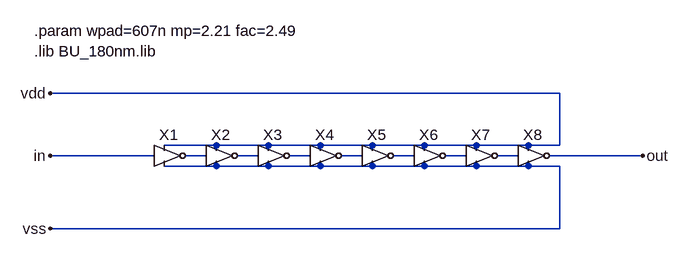
[diagram p0: schematic pad_buffer.asc]
pad_buffer.asc, the LTspice schematic file:
Version 4
SHEET 1 1168 680
WIRE 768 224 -16 224
WIRE 240 304 160 304
WIRE 320 304 240 304
WIRE 400 304 320 304
WIRE 480 304 400 304
WIRE 560 304 480 304
WIRE 640 304 560 304
WIRE 720 304 640 304
WIRE 768 304 768 224
WIRE 768 304 720 304
WIRE 144 320 -16 320
WIRE 224 320 192 320
WIRE 304 320 272 320
WIRE 384 320 352 320
WIRE 464 320 432 320
WIRE 544 320 512 320
WIRE 624 320 592 320
WIRE 704 320 672 320
WIRE 896 320 752 320
WIRE 240 336 160 336
WIRE 320 336 240 336
WIRE 400 336 320 336
WIRE 480 336 400 336
WIRE 560 336 480 336
WIRE 640 336 560 336
WIRE 720 336 640 336
WIRE 768 336 720 336
WIRE 768 432 768 336
WIRE 768 432 -16 432
FLAG -16 224 vdd
FLAG -16 320 in
FLAG 896 320 out
FLAG -16 432 vss
SYMBOL inv 160 320 R0
SYMATTR InstName X1
SYMATTR SpiceLine ll=180n wn={wpad} wp={wpad*mp}
SYMBOL inv 240 320 R0
SYMATTR InstName X2
SYMATTR SpiceLine ll=180n wn={wpad*fac} wp={wpad*fac*mp}
SYMBOL inv 320 320 R0
SYMATTR InstName X3
SYMATTR SpiceLine ll=180n wn={wpad*pow(fac,2)} wp={wpad*pow(fac,2)*mp}
SYMBOL inv 400 320 R0
SYMATTR InstName X4
SYMATTR SpiceLine ll=180n wn={wpad*pow(fac,3)} wp={wpad*pow(fac,3)*mp}
SYMBOL inv 480 320 R0
SYMATTR InstName X5
SYMATTR SpiceLine ll=180n wn={wpad*pow(fac,4)} wp={wpad*pow(fac,4)*mp}
SYMBOL inv 560 320 R0
SYMATTR InstName X6
SYMATTR SpiceLine ll=180n wn={wpad*pow(fac,5)} wp={wpad*pow(fac,5)*mp}
SYMBOL inv 640 320 R0
SYMATTR InstName X7
SYMATTR SpiceLine ll=180n wn={wpad*pow(fac,6)} wp={wpad*pow(fac,6)*mp}
SYMBOL inv 720 320 R0
SYMATTR InstName X8
SYMATTR SpiceLine ll=180n wn={wpad*pow(fac,7)} wp={wpad*pow(fac,7)*mp}
TEXT -40 128 Left 2 !.param wpad=607n mp=2.21 fac=2.49\n.lib BU_180nm.lib

The netlist it stands for:
* pad_buffer.asc
XX1 in N001 vdd vss inv ll=180n wn={wpad} wp={wpad*mp}  ; pins In _Q vdd vss
XX2 N001 N002 vdd vss inv ll=180n wn={wpad*fac} wp={wpad*fac*mp}  ; pins In _Q vdd vss
XX3 N002 N003 vdd vss inv ll=180n wn={wpad*pow(fac,2)} wp={wpad*pow(fac,2)*mp}  ; pins In _Q vdd vss
XX4 N003 N004 vdd vss inv ll=180n wn={wpad*pow(fac,3)} wp={wpad*pow(fac,3)*mp}  ; pins In _Q vdd vss
XX5 N004 N005 vdd vss inv ll=180n wn={wpad*pow(fac,4)} wp={wpad*pow(fac,4)*mp}  ; pins In _Q vdd vss
XX6 N005 N006 vdd vss inv ll=180n wn={wpad*pow(fac,5)} wp={wpad*pow(fac,5)*mp}  ; pins In _Q vdd vss
XX7 N006 N007 vdd vss inv ll=180n wn={wpad*pow(fac,6)} wp={wpad*pow(fac,6)*mp}  ; pins In _Q vdd vss
XX8 N007 out vdd vss inv ll=180n wn={wpad*pow(fac,7)} wp={wpad*pow(fac,7)*mp}  ; pins In _Q vdd vss
.param wpad=607n mp=2.21 fac=2.49
.lib BU_180nm.lib
.backanno
.end